# Altium schematic sheet matrix.SchDoc
size A4
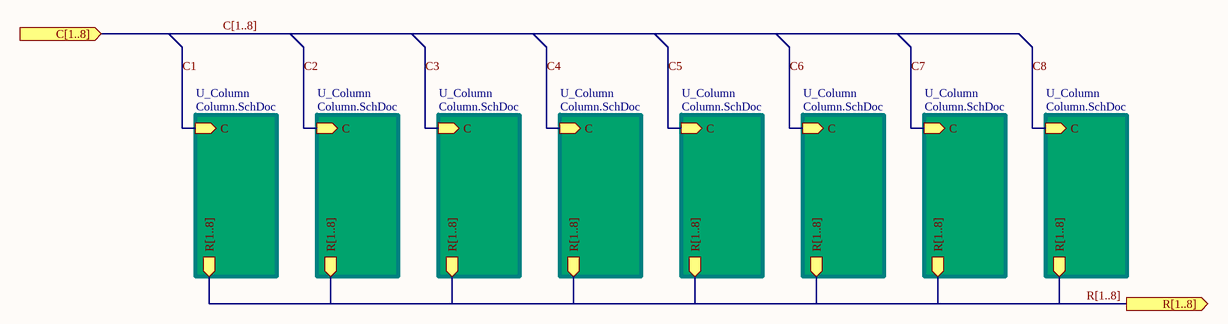
[diagram p0: matrix.SchDoc]

## Sub-sheets
U_Column = Column.SchDoc: C (in), R[1..8] (out)
U_Column = Column.SchDoc: C (in), R[1..8] (out)
U_Column = Column.SchDoc: C (in), R[1..8] (out)
U_Column = Column.SchDoc: C (in), R[1..8] (out)
U_Column = Column.SchDoc: C (in), R[1..8] (out)
U_Column = Column.SchDoc: C (in), R[1..8] (out)
U_Column = Column.SchDoc: C (in), R[1..8] (out)
U_Column = Column.SchDoc: C (in), R[1..8] (out)

## Ports
C[1..8] (in), R[1..8] (out)

## Nets
C1: sheet U_Column/C
C2: sheet U_Column/C
C3: sheet U_Column/C
C4: sheet U_Column/C
C5: sheet U_Column/C
C6: sheet U_Column/C
C7: sheet U_Column/C
C8: sheet U_Column/C

## Buses and harness runs
bus C[1..8] = port C[1..8]
bus R[1..8] = port R[1..8] = sheet U_Column/R[1..8]